# EAGLE schematic TR808_Project-2 (EAGLE 9.6.2)
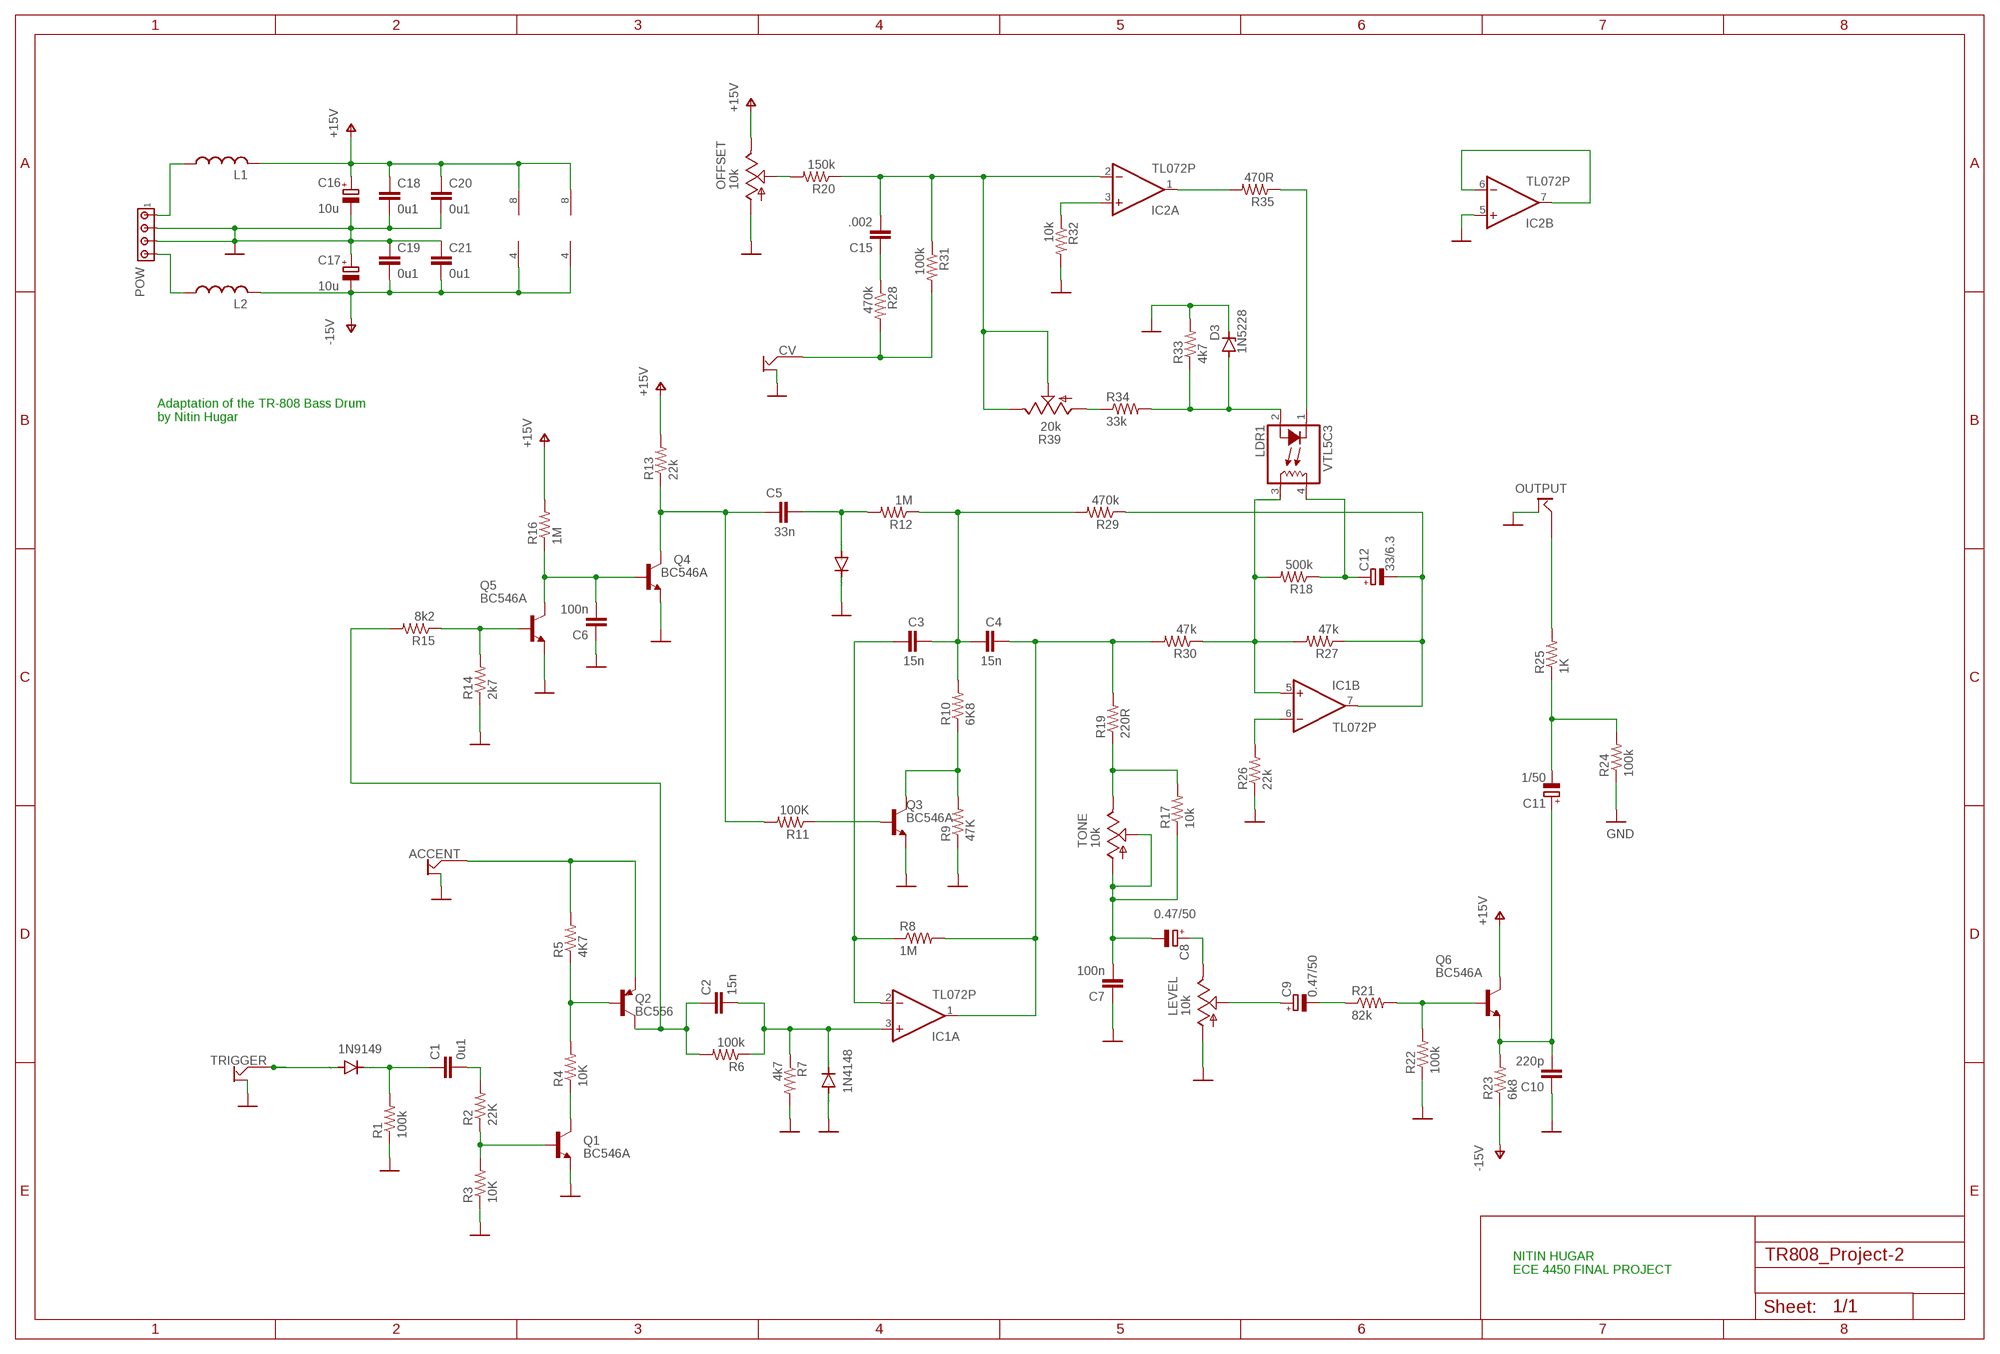
[diagram p0: schematic, sheet 1]

## Parts
1N4148  1N4148  1N4148DO35-10  [DO35-10]
ACCENT  OFFBOARD2JACKALT_AARON  [OFFBOARD2JACKALT]
C1  0u1  C-EU050-025X075  [C050-025X075]
C2  15n  C-EU050-025X075  [C050-025X075]
C3  15n  C-EU050-025X075  [C050-025X075]
C4  15n  C-EU050-025X075  [C050-025X075]
C5  33n  C-EU050-025X075  [C050-025X075]
C6  100n  C-EU050-025X075  [C050-025X075]
C7  100n  C-EU050-025X075  [C050-025X075]
C8  0.47/50  CPOL-EUE1.8-4  [E1,8-4]
C9  0.47/50  CPOL-EUE1.8-4  [E1,8-4]
C10  220p  C-EU050-025X075  [C050-025X075]
C11  1/50  CPOL-EUE1.8-4  [E1,8-4]
C12  33/6.3  CPOL-EUE1.8-4  [E1,8-4]
C15  .002  C-EU050-025X075  [C050-025X075]
C16  10u  CPOL-EUE1.8-4  [E1,8-4]
C17  10u  CPOL-EUE1.8-4  [E1,8-4]
C18  0u1  C-EU050-025X075  [C050-025X075]
C19  0u1  C-EU050-025X075  [C050-025X075]
C20  0u1  C-EU050-025X075  [C050-025X075]
C21  0u1  C-EU050-025X075  [C050-025X075]
CV  OFFBOARD2JACKALT_AARON  [OFFBOARD2JACKALT]
D1  1N9149  DIODE-D-10  [D-10]
D2  1N4148  1N4148DO35-10  [DO35-10]
D3  1N5228  ZENER-DIODEC1702-15  [C1702-15]
IC1  TL072P  [DIL08]
IC2  TL072P  [DIL08]
L1  L-US0207/10  [0207/10]
L2  L-US0207/10  [0207/10]
LDR1  VTL5C3  VTL5C9  [VTL5C]
LEVEL  10k  TRIM_US-B64Y  [B64Y]
OFFSET  10k  TRIM_US-B64Y  [B64Y]
OUTPUT  OFFBOARD2JACKALT_AARON  [OFFBOARD2JACKALT]
POW  MTA04-156  [1X4MTA]
Q1  BC546A  [TO92-EBC]
Q2  BC556  [TO92-EBC]
Q3  BC546A  [TO92-EBC]
Q4  BC546A  [TO92-EBC]
Q5  BC546A  [TO92-EBC]
Q6  BC546A  [TO92-EBC]
R1  100k  R-US_0207/10  [0207/10]
R2  22K  R-US_0207/10  [0207/10]
R3  10K  R-US_0207/10  [0207/10]
R4  10K  R-US_0207/10  [0207/10]
R5  4K7  R-US_0207/10  [0207/10]
R6  100k  R-US_0207/10  [0207/10]
R7  4k7  R-US_0207/10  [0207/10]
R8  1M  R-US_0207/10  [0207/10]
R9  47K  R-US_0207/10  [0207/10]
R10  6K8  R-US_0207/10  [0207/10]
R11  100K  R-US_0207/10  [0207/10]
R12  1M  R-US_0207/10  [0207/10]
R13  22k  R-US_0207/10  [0207/10]
R14  2k7  R-US_0207/10  [0207/10]
R15  8k2  R-US_0207/10  [0207/10]
R16  1M  R-US_0207/10  [0207/10]
R17  10k  R-US_0207/10  [0207/10]
R18  500k  R-US_0207/10  [0207/10]
R19  220R  R-US_0207/10  [0207/10]
R20  150k  R-US_0207/10  [0207/10]
R21  82k  R-US_0207/10  [0207/10]
R22  100k  R-US_0207/10  [0207/10]
R23  6k8  R-US_0207/10  [0207/10]
R24  100k  R-US_0207/10  [0207/10]
R25  1K  R-US_0207/10  [0207/10]
R26  22k  R-US_0207/10  [0207/10]
R27  47k  R-US_0207/10  [0207/10]
R28  470k  R-US_0207/10  [0207/10]
R29  470k  R-US_0207/10  [0207/10]
R30  47k  R-US_0207/10  [0207/10]
R31  100k  R-US_0207/10  [0207/10]
R32  10k  R-US_0207/10  [0207/10]
R33  4k7  R-US_0207/10  [0207/10]
R34  33k  R-US_0207/10  [0207/10]
R35  470R  R-US_0207/10  [0207/10]
R39  20k  TRIM_US-B64Y  [B64Y]
TONE  10k  TRIM_US-B64Y  [B64Y]
TRIGGER  OFFBOARD2JACKALT_AARON  [OFFBOARD2JACKALT]

## Nets
D1: C1.1 D1.C R1.2
GND: 1N4148.A ACCENT.GND C6.1 C7.1 C10.1 C16.- C17.+ C18.2 C19.1 C20.2 C21.1 CV.GND D2.C D3.C IC2.5(B:+IN) LEVEL.A OFFSET.A OUTPUT.GND POW.2 POW.3 Q1.E Q3.E Q4.E Q5.E R1.1 R3.1 R7.2 R9.1 R14.1 R22.1 R24.1 R26.1 R32.2 R33.2 TRIGGER.GND
N$1: C12.+ LDR1.4(L2) R18.1
N$2: C1.2 R2.2
N$3: Q1.B R2.1 R3.2
N$4: Q1.C R4.1
N$5: Q2.B R4.2 R5.1
N$6: ACCENT.SIGNAL Q2.E R5.2
N$7: D1.A TRIGGER.SIGNAL
N$8: C2.1 Q2.C R6.2 R15.2
N$9: 1N4148.C C2.2 IC1.3(A:+IN) R6.1 R7.1
N$10: Q3.B R11.1
N$11: C4.2 IC1.1(A:OUT) R8.2 R19.2 R30.2
N$12: Q3.C R9.2 R10.1
N$13: C3.2 C4.1 R10.2 R12.1 R29.2
N$14: C15.2 IC2.2(A:-IN) R20.1 R31.1 R39.E R39.S
N$15: C5.2 D2.A R12.2
N$16: C5.1 Q4.C R11.2 R13.1
N$17: Q5.B R14.2 R15.1
N$18: C6.2 Q4.B Q5.C R16.1
N$19: R17.2 R19.1 TONE.E
N$20: C8.+ LEVEL.E
N$21: C9.+ LEVEL.S
N$22: C9.- R21.1
N$23: Q6.B R21.2 R22.2
N$24: C10.2 C11.+ Q6.E R23.2
N$25: C11.- R24.2 R25.1
N$26: OUTPUT.SIGNAL R25.2
N$27: IC1.6(B:-IN) R26.2
N$28: IC1.5(B:+IN) LDR1.3(L1) R18.2 R27.2 R30.1
N$29: C12.- IC1.7(B:OUT) R27.1 R29.1
N$30: C15.1 R28.1
N$31: C7.2 C8.- R17.1 TONE.A TONE.S
N$32: IC2.3(A:+IN) R32.1
N$33: OFFSET.S R20.2
N$34: IC2.1(A:OUT) R35.2
N$35: R34.1 R39.A
N$36: IC2.6(B:-IN) IC2.7(B:OUT)
N$37: LDR1.1(C) R35.1
N$38: D3.A LDR1.2(A) R33.1 R34.2
N$39: CV.SIGNAL R28.2 R31.2
N$40: C3.1 IC1.2(A:-IN) R8.1
N$41: L1.1 POW.1
N$42: L2.1 POW.4
V+: C16.+ C18.1 C20.1 IC1.8(P:V+) IC2.8(P:V+) L1.2 OFFSET.E Q6.C R13.2 R16.2 ; supply symbol labelled +15V
V-: C17.- C19.2 C21.2 IC1.4(P:V-) IC2.4(P:V-) L2.2 R23.1 ; supply symbol labelled -15V

## Notes on the sheet
- Adaptation of the TR-808 Bass Drum 
  by Nitin Hugar
- NITIN HUGAR
  ECE 4450 FINAL PROJECT

## Library data of the parts
1N4148 D2 = diode:1N4148: DIODE high speed (Philips)
ACCENT CV OUTPUT TRIGGER = aaronlibrary:OFFBOARD2JACKALT_AARON
C1-C7 C10 C15 C18-C21 = rcl:C-EU: CAPACITOR, European symbol; SPICEPREFIX: C
C8 C9 C11 C12 C16 C17 = rcl:CPOL-EU: POLARIZED CAPACITOR, European symbol; SPICEPREFIX: C
D1 = diode:DIODE-: DIODE
D3 = diode:ZENER-DIODE: Z-Diode
IC1 IC2 = linear:TL072: OP AMP
L1 L2 = rcl:L-US: INDUCTOR, American symbol; SPICEPREFIX: L
LDR1 = optocoupler:VTL5C*: Low Cost Axial Vactrols Source: www.perkinelmer.com/opto ... vtl5c9_c10.pdf; MF: VACTEC PHOTO; MPN: VTL5C9; OC_FARNELL: 2067857; OC_NEWARK: 95F9033
LEVEL OFFSET R39 TONE = pot:TRIM_US-: POTENTIOMETER
POW = con-amp:MTA04-156: AMP connector
Q1 Q3-Q6 = transistor-npn:BC546*: NPN Transistor
Q2 = transistor-pnp:BC556*: PNP Transistror
R1-R35 = rcl:R-US_: RESISTOR, American symbol; SPICEPREFIX: R